# Altium schematic sheet voltage_level_translators_schematic.SchDoc: Measurement and voltage translator ICs
size A2; DocumentNumber: 4; SheetNumber: 4; SheetTotal: 8
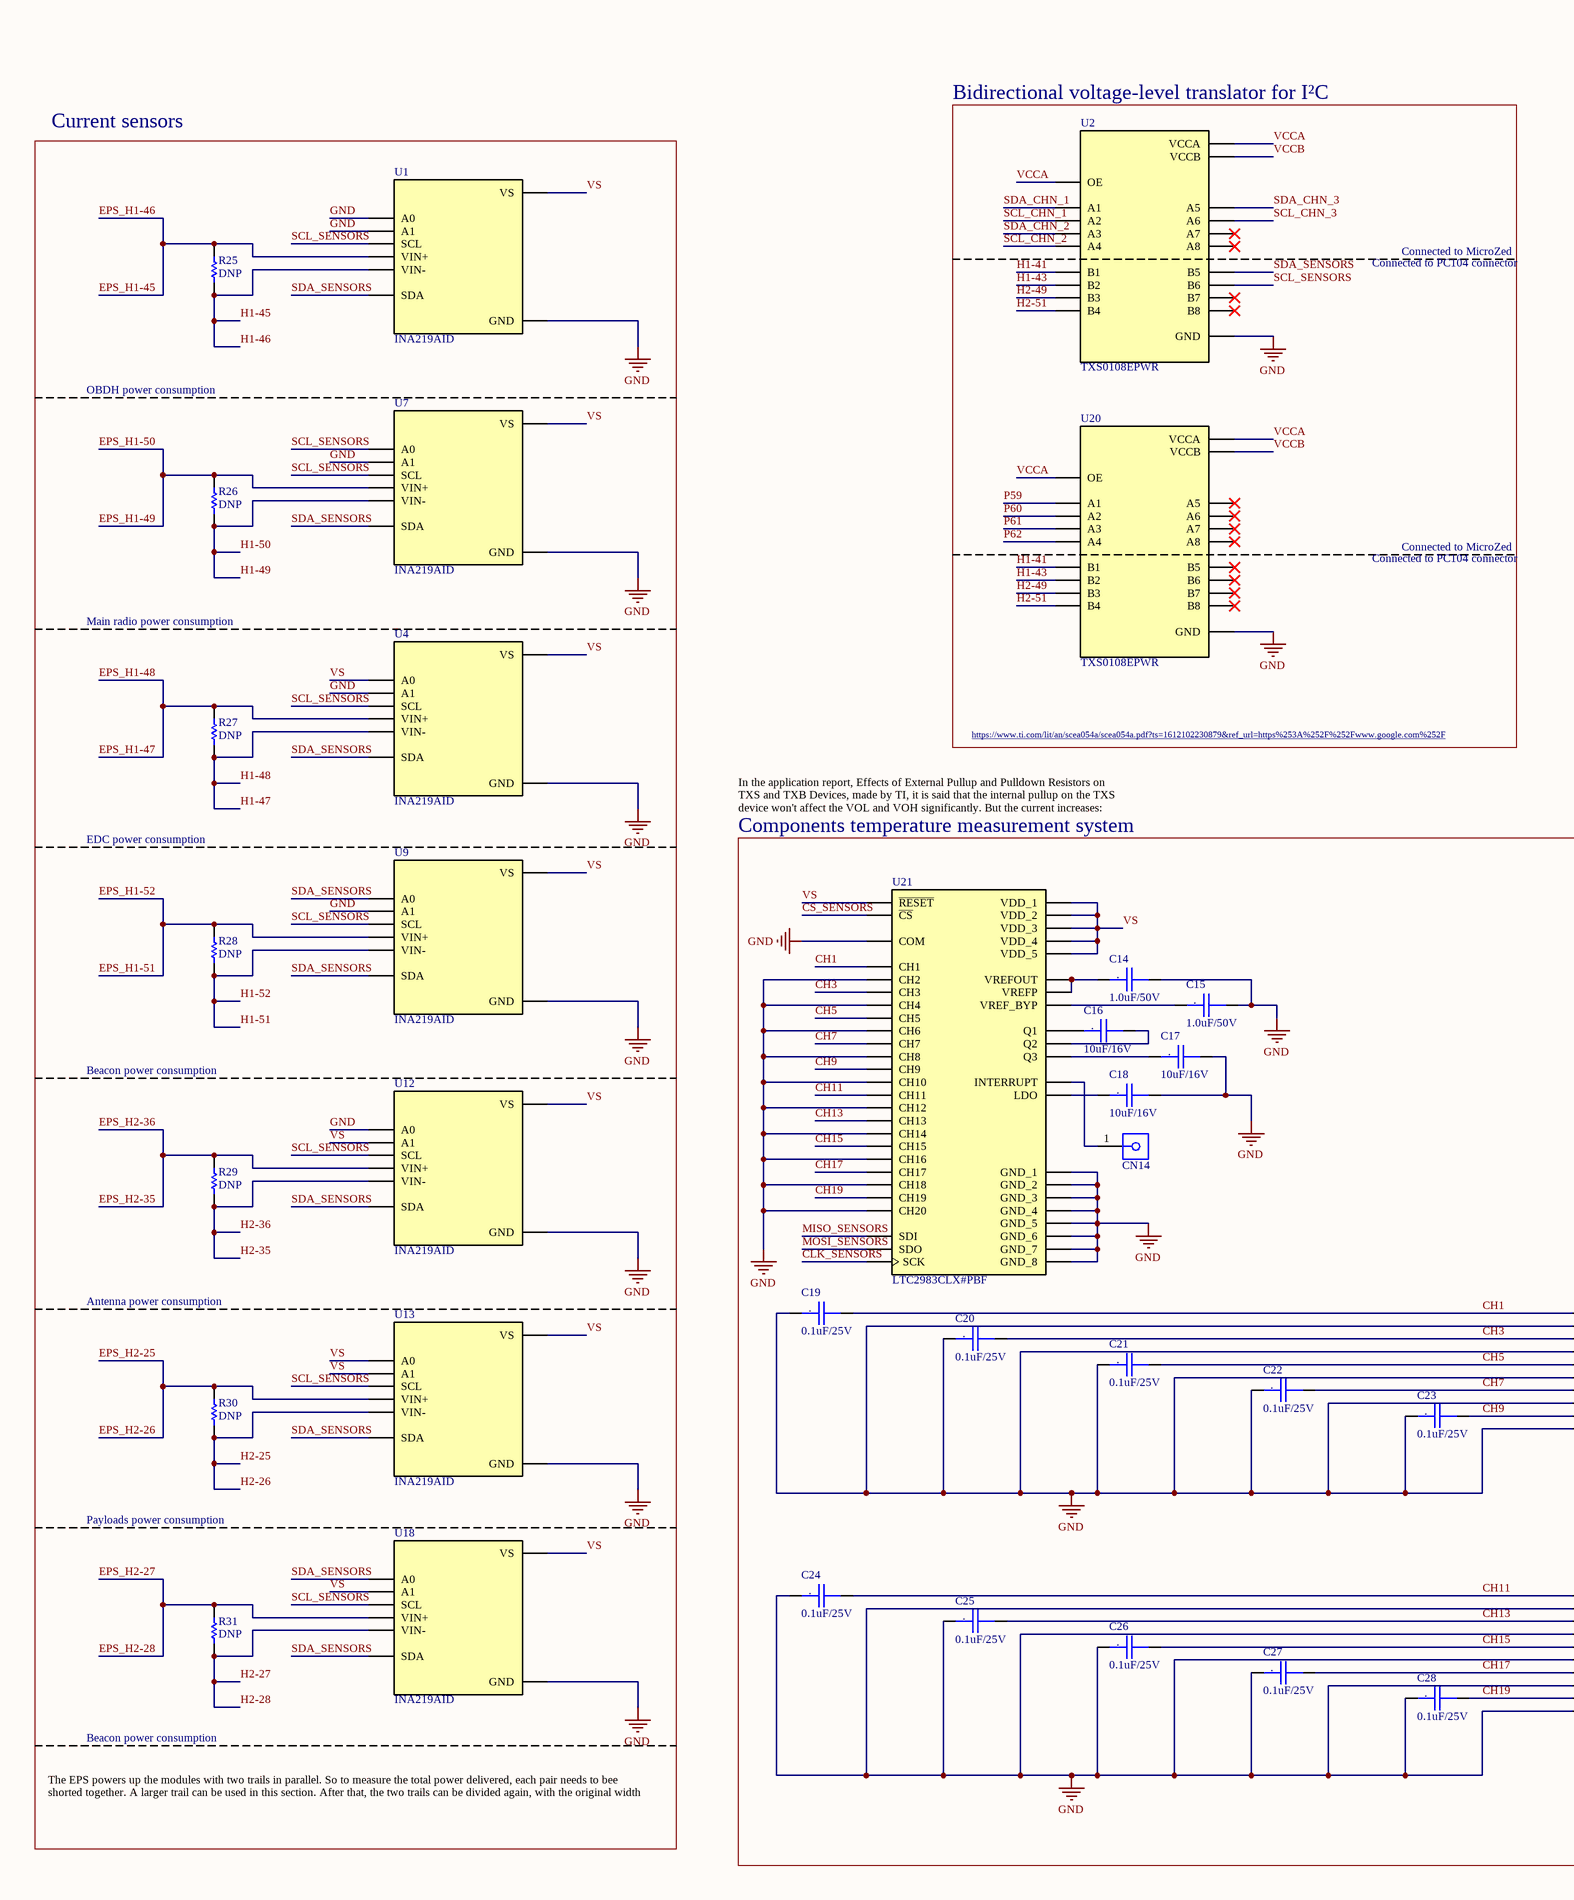
[diagram p0: voltage_level_translators_schematic.SchDoc, left]
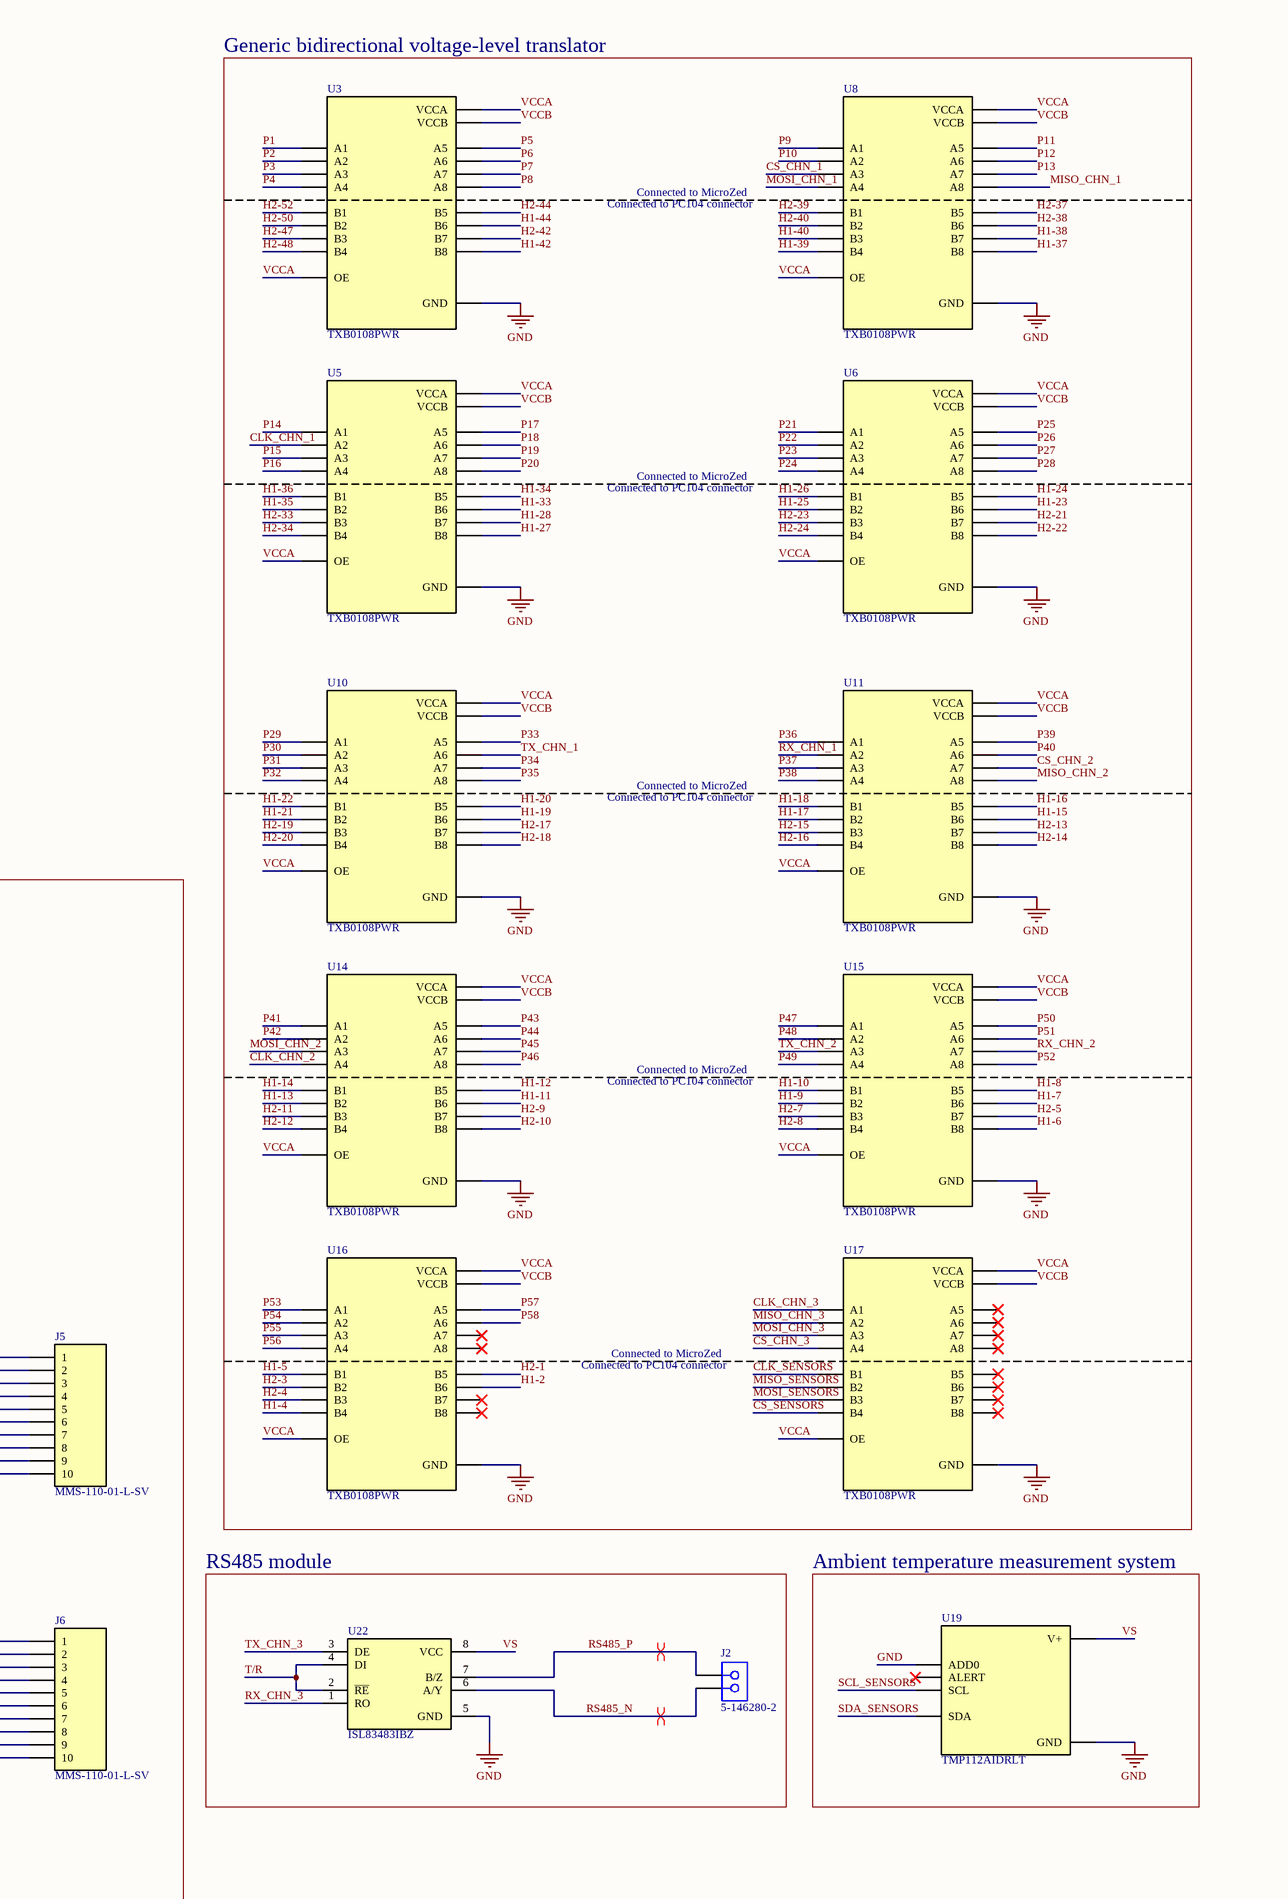
[diagram p1: voltage_level_translators_schematic.SchDoc, right]

## Parts
C14  1.0uF/50V  [CC0805]
C15  1.0uF/50V  [CC0805]
C16  10uF/16V  [CC1210]
C17  10uF/16V  [CC1210]
C18  10uF/16V  [CC1210]
C19  0.1uF/25V  [CC0805]
C20  0.1uF/25V  [CC0805]
C21  0.1uF/25V  [CC0805]
C22  0.1uF/25V  [CC0805]
C23  0.1uF/25V  [CC0805]
C24  0.1uF/25V  [CC0805]
C25  0.1uF/25V  [CC0805]
C26  0.1uF/25V  [CC0805]
C27  0.1uF/25V  [CC0805]
C28  0.1uF/25V  [CC0805]
CN14  TSW-101-05-T-S  [PIN BAR 1 2.54mm 180 GRAUS - Hide]  (value not drawn)
J2  5-146280-2  [PIN BAR 2 2.54mm 180 GRAUS]
J5  MMS-110-01-L-SV  [SAMTEC_MMS-110-01-L-SV]
J6  MMS-110-01-L-SV  [SAMTEC_MMS-110-01-L-SV]
R25  DNP  [0805]
R26  DNP  [0805]
R27  DNP  [0805]
R28  DNP  [0805]
R29  DNP  [0805]
R30  DNP  [0805]
R31  DNP  [0805]
U1  INA219AID  [SOIC127P599X175-8N]
U2  TXS0108EPWR  [SOP65P640X120-20N]
U3  TXB0108PWR  [SOP65P640X120-20N]
U4  INA219AID  [SOIC127P599X175-8N]
U5  TXB0108PWR  [SOP65P640X120-20N]
U6  TXB0108PWR  [SOP65P640X120-20N]
U7  INA219AID  [SOIC127P599X175-8N]
U8  TXB0108PWR  [SOP65P640X120-20N]
U9  INA219AID  [SOIC127P599X175-8N]
U10  TXB0108PWR  [SOP65P640X120-20N]
U11  TXB0108PWR  [SOP65P640X120-20N]
U12  INA219AID  [SOIC127P599X175-8N]
U13  INA219AID  [SOIC127P599X175-8N]
U14  TXB0108PWR  [SOP65P640X120-20N]
U15  TXB0108PWR  [SOP65P640X120-20N]
U16  TXB0108PWR  [SOP65P640X120-20N]
U17  TXB0108PWR  [SOP65P640X120-20N]
U18  INA219AID  [SOIC127P599X175-8N]
U19  TMP112AIDRLT  [SOT50P160X60-6N]
U20  TXS0108EPWR  [SOP65P640X120-20N]
U21  LTC2983CLX#PBF  [QFP50P900X900X160-48N]
U22  ISL83483IBZ  [SOIC127P600X175-8N]

## Blocks framed on the sheet
Generic bidirectional voltage-level translator: U3 U5 U6 U8 U10 U11 U14-U17
Bidirectional voltage-level translator for I²C: U2 U20
Current sensors: R25-R31 U1 U4 U7 U9 U12 U13 U18
Components temperature measurement system: C14-C28 CN14 J5 J6 U21
RS485 module: J2 U22
Ambient temperature measurement system: U19

## Nets
GND: C14.2 C15.2 C17.2 C18.2 C19.1 C20.1 C21.1 C22.1 C23.1 C24.1 C25.1 C26.1 C27.1 C28.1 J5.2 J5.4 J5.6 J5.8 J5.10 J6.2 J6.4 J6.6 J6.8 J6.10 U1.1(A1) U1.2(A0) U1.6(GND) U2.11(GND) U3.11(GND) U4.1(A1) U4.6(GND) U5.11(GND) U6.11(GND) U7.1(A1) U7.6(GND) U8.11(GND) U9.1(A1) U9.6(GND) U10.11(GND) U11.11(GND) U12.2(A0) U12.6(GND) U13.6(GND) U14.11(GND) U15.11(GND) U16.11(GND) U17.11(GND) U18.6(GND) U19.2(GND) U19.4(ADD0) U20.11(GND) U21.1(GND_1) U21.3(GND_2) U21.5(GND_3) U21.7(GND_4) U21.9(GND_5) U21.12(GND_6) U21.15(GND_7) U21.17(CH2) U21.19(CH4) U21.21(CH6) U21.23(CH8) U21.25(CH10) U21.27(CH12) U21.29(CH14) U21.31(CH16) U21.33(CH18) U21.35(CH20) U21.36(COM) U21.44(GND_8) U22.5(GND)
CH1: C19.2 J5.1 U21.16(CH1)
CH3: C20.2 J5.3 U21.18(CH3)
CH5: C21.2 J5.5 U21.20(CH5)
CH7: C22.2 J5.7 U21.22(CH7)
CH9: C23.2 J5.9 U21.24(CH9)
CH11: C24.2 J6.1 U21.26(CH11)
CH13: C25.2 J6.3 U21.28(CH13)
CH15: C26.2 J6.5 U21.30(CH15)
CH17: C27.2 J6.7 U21.32(CH17)
CH19: C28.2 J6.9 U21.34(CH19)
CLK_CHN_1: U5.3(A2)
CLK_CHN_2: U14.5(A4)
CLK_CHN_3: U17.1(A1)
CLK_SENSORS: U17.20(B1) U21.38(SCK)
CS_CHN_1: U8.4(A3)
CS_CHN_2: U11.8(A7)
CS_CHN_3: U17.5(A4)
CS_SENSORS: U17.16(B4) U21.41(~{CS})
EPS_H1-45: R25.1 U1.8(VIN+)  [also labelled EPS_H1-46]
EPS_H1-47: R27.1 U4.8(VIN+)  [also labelled EPS_H1-48]
EPS_H1-49: R26.1 U7.8(VIN+)  [also labelled EPS_H1-50]
EPS_H1-51: R28.1 U9.8(VIN+)  [also labelled EPS_H1-52]
EPS_H2-25: R30.1 U13.8(VIN+)  [also labelled EPS_H2-26]
EPS_H2-27: R31.1 U18.8(VIN+)  [also labelled EPS_H2-28]
EPS_H2-35: R29.1 U12.8(VIN+)  [also labelled EPS_H2-36]
H1-2: U16.14(B6)
H1-4: U16.16(B4)
H1-5: U16.20(B1)
H1-6: U15.12(B8)
H1-7: U15.14(B6)
H1-8: U15.15(B5)
H1-9: U15.18(B2)
H1-10: U15.20(B1)
H1-11: U14.14(B6)
H1-12: U14.15(B5)
H1-13: U14.18(B2)
H1-14: U14.20(B1)
H1-15: U11.14(B6)
H1-16: U11.15(B5)
H1-17: U11.18(B2)
H1-18: U11.20(B1)
H1-19: U10.14(B6)
H1-20: U10.15(B5)
H1-21: U10.18(B2)
H1-22: U10.20(B1)
H1-23: U6.14(B6)
H1-24: U6.15(B5)
H1-25: U6.18(B2)
H1-26: U6.20(B1)
H1-27: U5.12(B8)
H1-28: U5.13(B7)
H1-33: U5.14(B6)
H1-34: U5.15(B5)
H1-35: U5.18(B2)
H1-36: U5.20(B1)
H1-37: U8.12(B8)
H1-38: U8.13(B7)
H1-39: U8.16(B4)
H1-40: U8.17(B3)
H1-41: U2.20(B1) U20.20(B1)
H1-42: U3.12(B8)
H1-43: U2.18(B2) U20.18(B2)
H1-44: U3.14(B6)
H1-45: R25.2 U1.7(VIN-)  [also labelled H1-46]
H1-47: R27.2 U4.7(VIN-)  [also labelled H1-48]
H1-49: R26.2 U7.7(VIN-)  [also labelled H1-50]
H1-51: R28.2 U9.7(VIN-)  [also labelled H1-52]
H2-1: U16.15(B5)
H2-3: U16.18(B2)
H2-4: U16.17(B3)
H2-5: U15.13(B7)
H2-7: U15.17(B3)
H2-8: U15.16(B4)
H2-9: U14.13(B7)
H2-10: U14.12(B8)
H2-11: U14.17(B3)
H2-12: U14.16(B4)
H2-13: U11.13(B7)
H2-14: U11.12(B8)
H2-15: U11.17(B3)
H2-16: U11.16(B4)
H2-17: U10.13(B7)
H2-18: U10.12(B8)
H2-19: U10.17(B3)
H2-20: U10.16(B4)
H2-21: U6.13(B7)
H2-22: U6.12(B8)
H2-23: U6.17(B3)
H2-24: U6.16(B4)
H2-25: R30.2 U13.7(VIN-)  [also labelled H2-26]
H2-27: R31.2 U18.7(VIN-)  [also labelled H2-28]
H2-33: U5.17(B3)
H2-34: U5.16(B4)
H2-35: R29.2 U12.7(VIN-)  [also labelled H2-36]
H2-37: U8.15(B5)
H2-38: U8.14(B6)
H2-39: U8.20(B1)
H2-40: U8.18(B2)
H2-42: U3.13(B7)
H2-44: U3.15(B5)
H2-47: U3.17(B3)
H2-48: U3.16(B4)
H2-49: U2.17(B3) U20.17(B3)
H2-50: U3.18(B2)
H2-51: U2.16(B4) U20.16(B4)
H2-52: U3.20(B1)
MISO_CHN_1: U8.9(A8)
MISO_CHN_2: U11.9(A8)
MISO_CHN_3: U17.3(A2)
MISO_SENSORS: U17.18(B2) U21.40(SDI)
MOSI_CHN_1: U8.5(A4)
MOSI_CHN_2: U14.4(A3)
MOSI_CHN_3: U17.4(A3)
MOSI_SENSORS: U17.17(B3) U21.39(SDO)
P1: U3.1(A1)
P2: U3.3(A2)
P3: U3.4(A3)
P4: U3.5(A4)
P5: U3.6(A5)
P6: U3.7(A6)
P7: U3.8(A7)
P8: U3.9(A8)
P9: U8.1(A1)
P10: U8.3(A2)
P11: U8.6(A5)
P12: U8.7(A6)
P13: U8.8(A7)
P14: U5.1(A1)
P15: U5.4(A3)
P16: U5.5(A4)
P17: U5.6(A5)
P18: U5.7(A6)
P19: U5.8(A7)
P20: U5.9(A8)
P21: U6.1(A1)
P22: U6.3(A2)
P23: U6.4(A3)
P24: U6.5(A4)
P25: U6.6(A5)
P26: U6.7(A6)
P27: U6.8(A7)
P28: U6.9(A8)
P29: U10.1(A1)
P30: U10.3(A2)
P31: U10.4(A3)
P32: U10.5(A4)
P33: U10.6(A5)
P34: U10.8(A7)
P35: U10.9(A8)
P36: U11.1(A1)
P37: U11.4(A3)
P38: U11.5(A4)
P39: U11.6(A5)
P40: U11.7(A6)
P41: U14.1(A1)
P42: U14.3(A2)
P43: U14.6(A5)
P44: U14.7(A6)
P45: U14.8(A7)
P46: U14.9(A8)
P47: U15.1(A1)
P48: U15.3(A2)
P49: U15.5(A4)
P50: U15.6(A5)
P51: U15.7(A6)
P52: U15.9(A8)
P53: U16.1(A1)
P54: U16.3(A2)
P55: U16.4(A3)
P56: U16.5(A4)
P57: U16.6(A5)
P58: U16.7(A6)
P59: U20.1(A1)
P60: U20.3(A2)
P61: U20.4(A3)
P62: U20.5(A4)
RS485_N: J2.2 U22.6(A/Y)
RS485_P: J2.1 U22.7(B/Z)
RX_CHN_1: U11.3(A2)
RX_CHN_2: U15.8(A7)
RX_CHN_3: U22.1(RO)
SCL_CHN_1: U2.3(A2)
SCL_CHN_2: U2.5(A4)
SCL_CHN_3: U2.7(A6)
SCL_SENSORS: U1.4(SCL) U2.14(B6) U4.4(SCL) U7.2(A0) U7.4(SCL) U9.4(SCL) U12.4(SCL) U13.4(SCL) U18.4(SCL) U19.1(SCL)
SDA_CHN_1: U2.1(A1)
SDA_CHN_2: U2.4(A3)
SDA_CHN_3: U2.6(A5)
SDA_SENSORS: U1.3(SDA) U2.15(B5) U4.3(SDA) U7.3(SDA) U9.2(A0) U9.3(SDA) U12.3(SDA) U13.3(SDA) U18.2(A0) U18.3(SDA) U19.6(SDA)
T/R: U22.2(~{RE}) U22.4(DI)
TX_CHN_1: U10.7(A6)
TX_CHN_2: U15.4(A3)
TX_CHN_3: U22.3(DE)
VCCA: U2.2(VCCA) U2.10(OE) U3.2(VCCA) U3.10(OE) U5.2(VCCA) U5.10(OE) U6.2(VCCA) U6.10(OE) U8.2(VCCA) U8.10(OE) U10.2(VCCA) U10.10(OE) U11.2(VCCA) U11.10(OE) U14.2(VCCA) U14.10(OE) U15.2(VCCA) U15.10(OE) U16.2(VCCA) U16.10(OE) U17.2(VCCA) U17.10(OE) U20.2(VCCA) U20.10(OE)
VCCB: U2.19(VCCB) U3.19(VCCB) U5.19(VCCB) U6.19(VCCB) U8.19(VCCB) U10.19(VCCB) U11.19(VCCB) U14.19(VCCB) U15.19(VCCB) U16.19(VCCB) U17.19(VCCB) U20.19(VCCB)
VS: U1.5(VS) U4.2(A0) U4.5(VS) U7.5(VS) U9.5(VS) U12.1(A1) U12.5(VS) U13.1(A1) U13.2(A0) U13.5(VS) U18.1(A1) U18.5(VS) U19.5(V+) U21.2(VDD_1) U21.4(VDD_2) U21.6(VDD_3) U21.8(VDD_4) U21.42(~{RESET}) U21.45(VDD_5) U22.8(VCC)
NetC14_1: C14.1 U21.13(VREFOUT) U21.14(VREFP)
NetC15_1: C15.1 U21.11(VREF_BYP)
NetC16_1: C16.1 U21.48(Q1)
NetC16_2: C16.2 U21.47(Q2)
NetC17_1: C17.1 U21.46(Q3)
NetC18_1: C18.1 U21.43(LDO)
NetCN14_1: CN14.1 U21.37(INTERRUPT)

Not connected (* = marked no-connect by the designer): U2 8(A7)* 9(A8)* 12(B8)* 13(B7)*; U16 8(A7)* 9(A8)* 12(B8)* 13(B7)*; U17 6(A5)* 7(A6)* 8(A7)* 9(A8)* 12(B8)* 13(B7)* 14(B6)* 15(B5)*; U19 3(ALERT)*; U20 6(A5)* 7(A6)* 8(A7)* 9(A8)* 12(B8)* 13(B7)* 14(B6)* 15(B5)*

## Layout directives
differential pair: RS485_N, RS485_P

## Notes on the sheet
- Connected to PC104 connector
- Connected to MicroZed
- OBDH power consumption
- Main radio power consumption
- https://www.ti.com/lit/an/scea054a/scea054a.pdf?ts=1612102230879&ref_url=https%253A%252F%252Fwww.google.com%252F
- In the application report, Effects of External Pullup and Pulldown Resistors on TXS and TXB Devices, made by TI, it is said that the internal pullup on the TXS device won't affect the VOL and VOH significantly. But the current increases:
- EDC power consumption
- Beacon power consumption
- Antenna power consumption
- Payloads power consumption
- The EPS powers up the modules with two trails in parallel. So to measure the total power delivered, each pair needs to bee shorted together. A larger trail can be used in this section. After that, the two trails can be divided again, with the original width
- Title:
- Project:
- SpaceLab - Federal University of Santa Catarina
- Date:
- Engineer:
- Revision:
- Sheet
- of
- Project Code:
- Size:
- A2
- (in symbol Cap_Cer_X7R_0.1uF_25V_0805) .
- (in symbol Cap_Cer_X7R_1.0uF_50V_0805) .
- (in symbol Cap_Cer_X7R_10uF_16V_1210) .

## Library data of the parts
C14 C15 = Cap_Cer_X7R_1.0uF_50V_0805: CAP CER 1.0uF 50V 10% X7R 0805; Manufacturer Part Number: C0805X105K5RACAUTO; NCM: 8532.24.10
C16-C18 = Cap_Cer_X7R_10uF_16V_1210: CAP CER 10uF 16V 10% X7R 1210; Manufacturer Part Number: C1210C106K4RACTU; NCM: 8532.24.10
C19-C28 = Cap_Cer_X7R_0.1uF_25V_0805: CAP CER 0.1uF 25V 10% X7R 0805; Manufacturer Part Number: CC0805KRX7R8BB104; NCM: 8532.24.10
CN14 = TSW-101-05-T-S: CONN HEADER 1POS .100" SNGL TIN; Manufacturer: Samtec Inc; N of Positions: 2; Pitch: 2.54mm; Mount Type: PTH; Supplier 1: Farnell; Supplier Part Number 1: 1925384; Supplier 2: Newark; Supplier Part Number 2: 84T5043; Supplier 3: Digi-Key; Supplier Part Number 3: SAM1019-02-ND; Supplier 4: Arrow; Supplier Part Number 4: T9xGEsh_w6igb0LY4EP_nwsWhIkhCEmR3qLYTGm2XzA; Supplier 5: Digi-Key; Supplier Part Number 5: SAM1019-01-ND; Supplier 6: Newark; Supplier Part Number 6: 69X6269; Manufacturer Part Number: TSW-101-05-T-S
J2 = 5-146280-2: 02 MODII HDR SRST B/A .100CL; MF: TE Connectivity; Product_Type: Connector; Number_of_Positions: 2; Centerline_Pitch: 2.54 mm[.1 in]; SnapEDA_Link: https://www.snapeda.com/parts/5-146280-2/TE%20Connectivity%20AMP%20Connectors/view-part/298520/?ref=snap; Price: None; EU_RoHS_Compliance: Compliant; Package: None; Availability: Unavailable; TE_purchase_URL: https://www.te.com/usa-en/product-5-146280-2.html?te_bu=Cor&te_type=disp&te_campaign=seda_glo_cor-seda-global-disp-prtnr-fy19-seda-model-bom-cta_sma-317_1&elqCampaignId=32493; Value: *; Manufacturer Part Number: 5-146280-2
J5 J6 = MMS-110-01-L-SV: Conn Socket Strip SKT 10 POS 2mm Solder ST Thru-Hole Tube; Package: None; Price: None; Value: *; Availability: Unavailable; Manufacturer Part Number: MMS-110-01-L-SV
R25-R31 = RDNP_0805: RES DNP 0805; Manufacturer Part Number: UR73V2ATTD47L0F; NCM: 8533.21.20
U1 U4 U7 U9 U12 U13 U18 = INA219AID: 26V, 12-bit, i2c output current/voltage/power monitor 8-SOIC -40 to 125; MF: Texas Instruments; Purchase-URL: https://pricing.snapeda.com/search/part/INA219AID/?ref=eda; Package: SOIC-8 Texas Instruments; SnapEDA_Link: https://www.snapeda.com/parts/INA219AID/Texas%20Instruments/view-part/522322/?ref=snap; Value: *; Price: None; Availability: Warning; Check_prices: https://www.snapeda.com/parts/INA219AID/Texas%20Instruments/view-part/522322/?ref=eda; Manufacturer Part Number: INA219AID
U2 U20 = TXS0108EPWR: 8-Bit Bidirectional Voltage-Level Shifter For Open-Drain And Push-Pull Application; MF: Texas Instruments; DigiKey-Purchase-URL: https://snapeda.com/shop?store=DigiKey&id=105750; Value: *; Texas_Instruments-Purchase-URL: https://snapeda.com/shop?store=Texas+Instruments&id=105750; Availability: Unavailable; Package: TSSOP-20 Texas Instruments; Mouser-Purchase-URL: https://snapeda.com/shop?store=Mouser&id=105750; SnapEDA_Link: https://www.snapeda.com/parts/TXS0108EPWR/Texas%20Instruments/view-part/105750/?ref=snap; Price: None; Manufacturer Part Number: TXS0108EPWR
U3 U5 U6 U8 U10 U11 U14-U17 = TXB0108PWR: 8-Bit Bidirectional Voltage-Level Shifter with Auto Direction Sensing and +/-15-kV ESD Protect 20-TSSOP -40 to 85; MF: Texas Instruments; SnapEDA_Link: https://www.snapeda.com/parts/TXB0108PWR/Texas%20Instruments/view-part/45111/?ref=snap; Digi-Key_Part_Number: 296-21527-1-ND; Texas_Instruments-Purchase-URL: https://snapeda.com/shop?store=Texas+Instruments&id=45111; Package: TSSOP-20 Texas Instruments; Value: *; Manufacturer Part Number: TXB0108PWR
U19 = TMP112AIDRLT: 0.5C 1.4V to 3.6V digital temperature sensor with I2C/SMBus in 2.56mm2 package 6-SOT-5X3 -40 to 125; MF: Texas Instruments; Texas_Instruments-Purchase-URL: https://snapeda.com/shop?store=Texas+Instruments&id=237309; Price: None; Mouser-Purchase-URL: https://snapeda.com/shop?store=Mouser&id=237309; Availability: Good; Package: SOT-5X3-6 Texas Instruments; SnapEDA_Link: https://www.snapeda.com/parts/TMP112AIDRLT/Texas%20Instruments/view-part/237309/?ref=snap; DigiKey-Purchase-URL: https://snapeda.com/shop?store=DigiKey&id=237309; Value: *; Manufacturer Part Number: TMP112AIDRLT
U21 = LTC2983CLX#PBF: IC SENSOR THERMAL; MF: Analog Devices; Value: *; SnapEDA_Link: https://www.snapeda.com/parts/LTC2983CLX%23PBF/Analog%20Devices/view-part/2895071/?ref=snap; Package: LQFP -48 Analog Devices; Manufacturer Part Number: LTC2983CLX#PBF
U22 = ISL83483IBZ: 1/1 Transceiver Half RS422, RS485 8-SOIC; Manufacturer Part Number: ISL83483IBZ-T; MF: Renesas Electronics; Price: None; SnapEDA_Link: https://www.snapeda.com/parts/ISL83483IBZ-T/Renesas%20Electronics%20America%20Inc./view-part/482105/?ref=snap; Availability: Unavailable; Value: *; Package: SOIC-8 Intersil